# Altium schematic sheet T3168.SchDoc
size A4
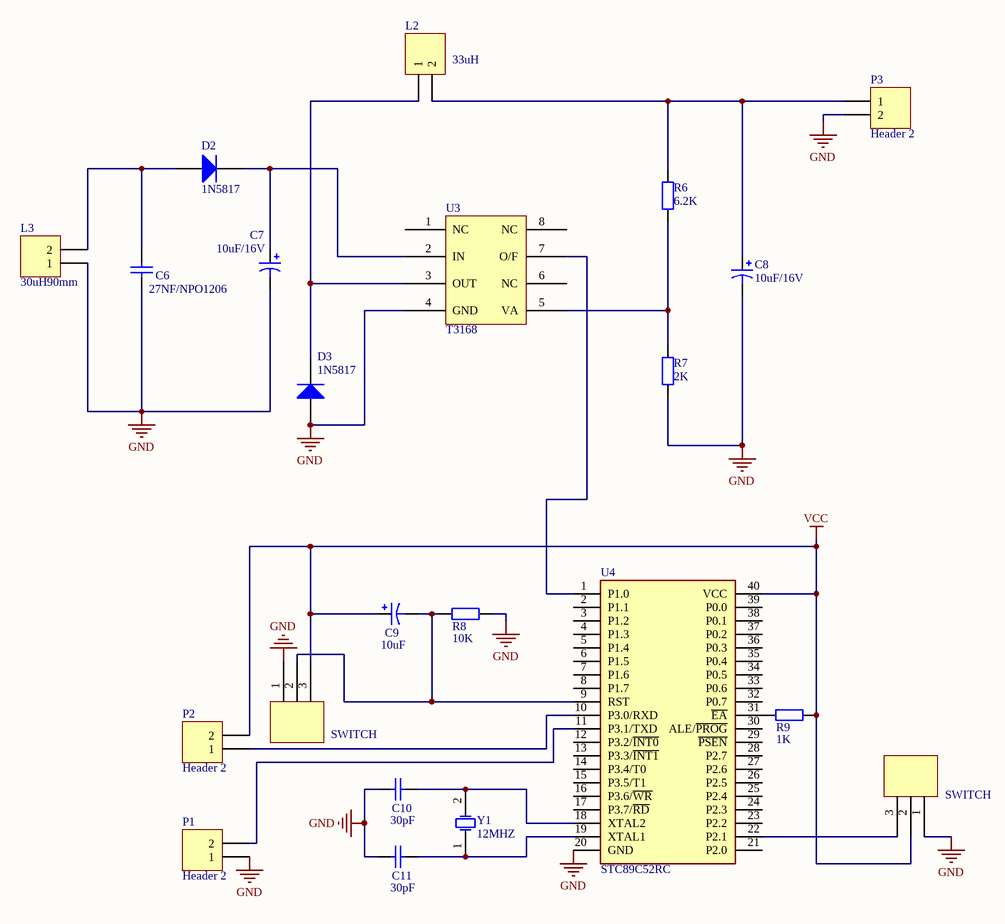
[diagram p0: T3168.SchDoc]

## Parts
(Parts that share a designator on the sheet are numbered #1, #2 ... from top to bottom, then left to right.)
*#1  SWITCH  [SWITCH]
*#2  SWITCH  [SWITCH]
C6  value 27NF/NPO1206  [RAD-0.3]  (hidden comment: Cap)
C7  value 10uF/16V  [RB7.6-15]  (hidden comment: Cap Pol1)
C8  value 10uF/16V  [RB7.6-15]  (hidden comment: Cap Pol1)
C9  value 10uF  [RB7.6-15]  (hidden comment: Cap Pol1)
C10  value 30pF  [RAD-0.3]  (hidden comment: Cap)
C11  value 30pF  [RAD-0.3]  (hidden comment: Cap)
D2  1N5817  [DO-41]
D3  1N5817  [DO-41]
L2  33uH  [HDR1X2]
L3  30uH90mm  [HDR1X2]
P1  Header 2  [HDR1X2]
P2  Header 2  [HDR1X2]
P3  Header 2  [HDR1X2]
R6  value 6.2K  [AXIAL-0.4]  (hidden comment: Res2)
R7  value 2K  [AXIAL-0.4]  (hidden comment: Res2)
R8  value 10K  [AXIAL-0.4]  (hidden comment: Res2)
R9  value 1K  [AXIAL-0.4]  (hidden comment: Res2)
U3  T3168  [XKT-801 - duplicate1]
U4  STC89C52RC  [STC89C52RC]
Y1  12MHZ  [R38]

## Nets
GND: *#1.1(OUT) *#2.1(OUT) C6.1 C7.2 C8.2 C10.1 C11.2 D3.1(A) L3.1 P1.1 P3.2 R7.1 R8.2 U3.4(GND) U4.20(GND)
VCC: *#1.3(OUT) *#2.2(OUT) C9.1 P2.2 R9.2 U4.40(VCC)
Net*#1_2: *#1.2(OUT) C9.2 R8.1 U4.9(RST)
Net*#2_3: *#2.3(OUT) U4.22(P2.1)
NetC6_2: C6.2 D2.1(A) L3.2
NetC7_1: C7.1 D2.2(K) U3.2(IN)
NetC8_1: C8.1 L2.2 P3.1 R6.2
NetC10_2: C10.2 U4.18(XTAL2) Y1.2(OSC2)
NetC11_1: C11.1 U4.19(XTAL1) Y1.1(OSC1)
NetD3_2: D3.2(K) L2.1 U3.3(OUT)
NetP1_2: P1.2 U4.11(P3.1/TXD)
NetP2_1: P2.1 U4.10(P3.0/RXD)
NetR6_1: R6.1 R7.2 U3.5(VA)
NetR9_1: R9.1 U4.31(~{EA})
NetU3_7: U3.7(O/F) U4.1(P1.0)

Not connected (* = marked no-connect by the designer): U3 1(NC) 6(NC) 8(NC); U4 2(P1.1) 3(P1.2) 4(P1.3) 5(P1.4) 6(P1.5) 7(P1.6) 8(P1.7) 12(P3.2/~{INT0}) 13(P3.3/~{INT1}) 14(P3.4/T0) 15(P3.5/T1) 16(P3.6/~{WR}) 17(P3.7/~{RD}) 21(P2.0) 23(P2.2) 24(P2.3) 25(P2.4) 26(P2.5) 27(P2.6) 28(P2.7) 29(~{PSEN}) 30(ALE/~{PROG}) 32(P0.7) 33(P0.6) 34(P0.5) 35(P0.4) 36(P0.3) 37(P0.2) 38(P0.1) 39(P0.0)

## Library data of the parts
C6 C10 C11 = Cap: Capacitor; Published: 8-Jun-2000; LatestRevisionDate: 17-Jul-2002; LatestRevisionNote: Re-released for DXP Platform.; PackageReference: RAD-0.3; Publisher: Altium Limited; PackageDescription: Radial Cap, Thru-Hole; 2 Leads; 0.3 in Pin Spacing
C7-C9 = Cap Pol1: Polarized Capacitor (Radial); Published: 8-Jun-2000; LatestRevisionDate: 17-Jul-2002; LatestRevisionNote: Re-released for DXP Platform.; PackageReference: RB7.6-15; Publisher: Altium Limited; PackageDescription: Polarized Capacitor (Radial); 2 Leads
D2 D3 = Diode 1N4001: 1 Amp General Purpose Rectifier; Published: 8-Jun-2000; LatestRevisionDate: 17-Jul-2002; LatestRevisionNote: Re-released for DXP Platform.; DatasheetVersion: 1998; PackageVersion: Aug-1999; PackageReference: DO-41; Publisher: Altium Limited; PackageDescription: Diode, Axial; Body 5.2 x 2.7 mm (LxDia. max), Lead Dia. 0.86 mm (max); Code_JEDEC: DO-204-AL; ComponentLink1Description: Manufacturer Link; ComponentLink1URL: http://www.fairchildsemi.com/; ComponentLink2Description: Datasheet; ComponentLink2URL: http://www.fairchildsemi.com/ds/1N%2F1N4001.pdf
L2 L3 P1-P3 = Header 2: Header, 2-Pin; LatestRevisionDate: 17-Jul-2002; LatestRevisionNote: Re-released for DXP Platform.; Publisher: Altium Limited
R6-R9 = Res2: Resistor; Published: 8-Jun-2000; LatestRevisionDate: 17-Jul-2002; LatestRevisionNote: Re-released for DXP Platform.; PackageReference: AXIAL-0.4; Publisher: Altium Limited; PackageDescription: Axial Device, Thru-Hole; 2 Leads; 0.4 in Pin Spacing
Y1 = XTAL: Crystal Oscillator; Published: 8-Jun-2000; LatestRevisionDate: 17-Jul-2002; LatestRevisionNote: Re-released for DXP Platform.; PackageReference: R38; Publisher: Altium Limited; PackageDescription: Crystal, Thru-Hole; 2 Leads; Body 3.1 x 8.2 mm (Dia.xH)